# EAGLE schematic timer (EAGLE 9.3.1)
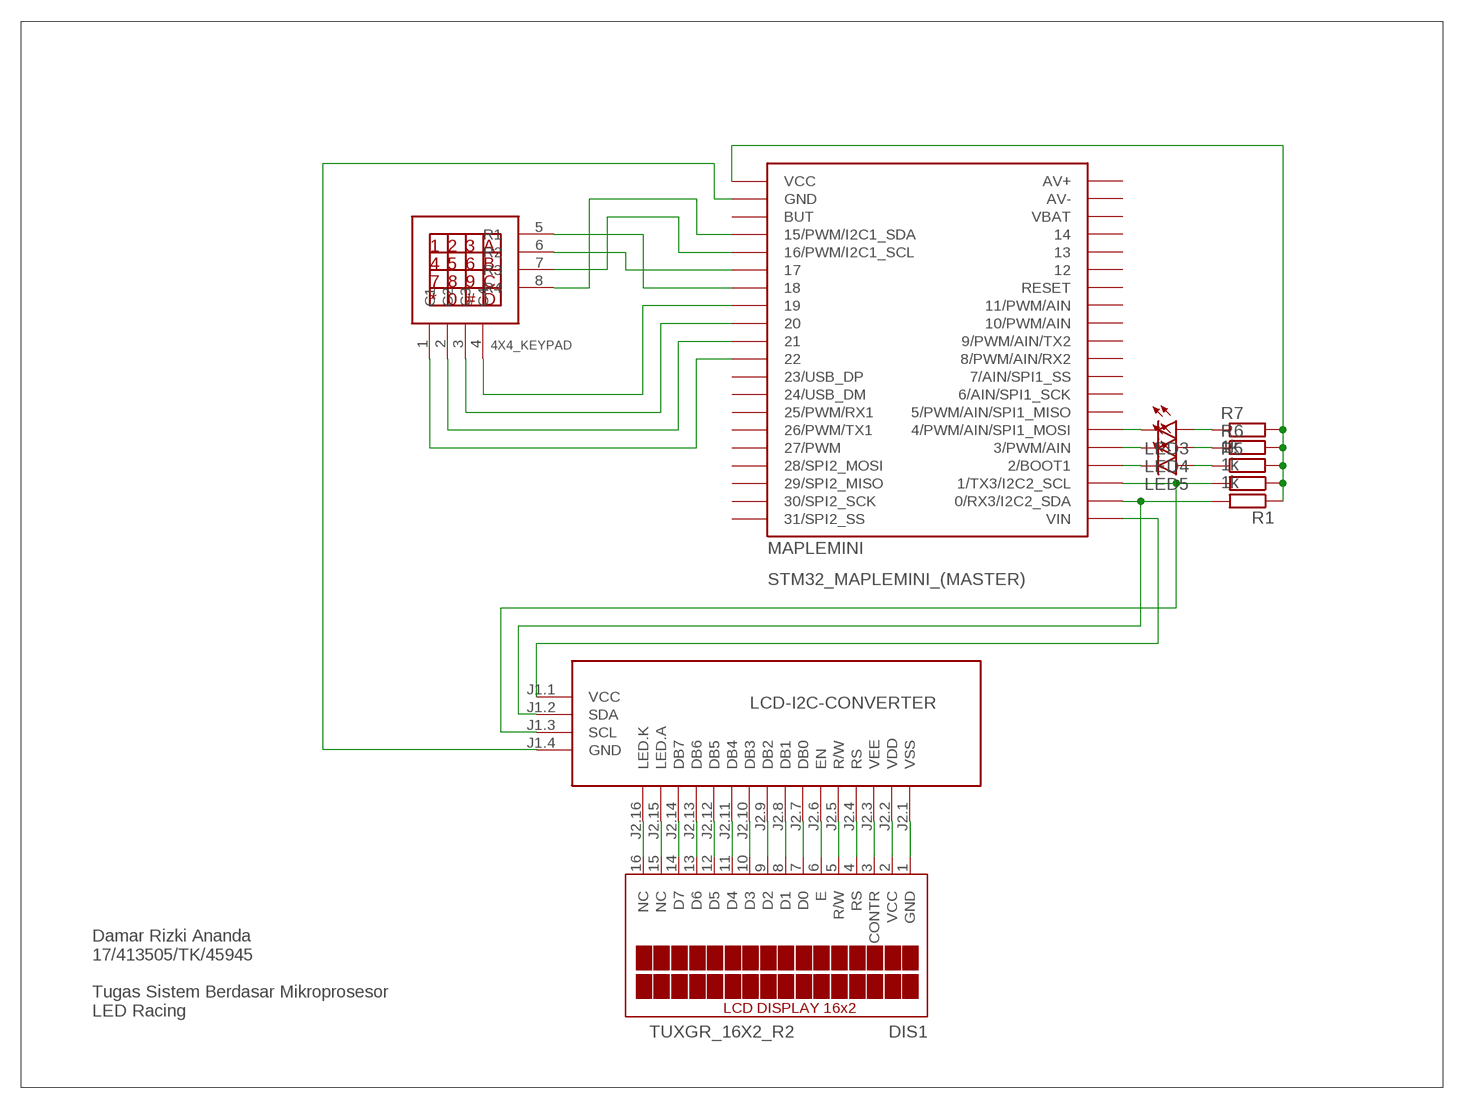
[diagram p0: schematic, sheet 1]

## Parts
4X4_KEYPAD  KEYPAD4X4  [KEYPAD4X4]
DIS1  TUXGR_16X2_R2  [TUXGR_16X2_R2]
LED3  LED3MM  [LED3MM]
LED4  LED3MM  [LED3MM]
LED5  LED3MM  [LED3MM]
R1  R-EU_0309/12  [0309/12]
R2  R-EU_0309/12  [0309/12]
R5  1k  R-EU_0204/7  [0204/7]
R6  1k  R-EU_0204/7  [0204/7]
R7  1k  R-EU_0204/7  [0204/7]
STM32_MAPLEMINI_(MASTER)  MAPLEMINI  [20-DIP]
U$1  LCD-I2C-CONVERTER  [LCD-I2C-CONVERTER]

## Nets
N$1: 4X4_KEYPAD.1(C1) STM32_MAPLEMINI_(MASTER).11
N$2: 4X4_KEYPAD.8(R4) STM32_MAPLEMINI_(MASTER).4(15/PWM/I2C1_SDA)
N$3: 4X4_KEYPAD.7(R3) STM32_MAPLEMINI_(MASTER).5(16/PWM/I2C1_SCL)
N$4: 4X4_KEYPAD.3(C3) STM32_MAPLEMINI_(MASTER).9
N$5: 4X4_KEYPAD.5(R1) STM32_MAPLEMINI_(MASTER).7
N$6: 4X4_KEYPAD.4(C4) STM32_MAPLEMINI_(MASTER).8
N$7: STM32_MAPLEMINI_(MASTER).21(VIN) U$1.J1.1(VCC)
N$8: R1.1 R2.1 R5.2 R6.2 R7.2 STM32_MAPLEMINI_(MASTER).1(VCC)
N$9: DIS1.1(GND) U$1.J2.1(VSS)
N$10: DIS1.2(VCC) U$1.J2.2(VDD)
N$11: DIS1.3(CONTR) U$1.J2.3(VEE)
N$12: DIS1.4(RS) U$1.J2.4(RS)
N$13: DIS1.5(R/W) U$1.J2.5(R/W)
N$14: DIS1.7(D0) U$1.J2.7(DB0)
N$15: DIS1.8(D1) U$1.J2.8(DB1)
N$16: DIS1.9(D2) U$1.J2.9(DB2)
N$17: DIS1.10(D3) U$1.J2.10(DB3)
N$18: DIS1.11(D4) U$1.J2.11(DB4)
N$19: DIS1.12(D5) U$1.J2.12(DB5)
N$20: DIS1.13(D6) U$1.J2.13(DB6)
N$21: DIS1.14(D7) U$1.J2.14(DB7)
N$22: DIS1.15(NC) U$1.J2.15(LED.A)
N$23: DIS1.16(NC) U$1.J2.16(LED.K)
N$24: DIS1.6(E) U$1.J2.6(EN)
N$25: R2.2 STM32_MAPLEMINI_(MASTER).23(1/TX3/I2C2_SCL) U$1.J1.3(SCL)
N$26: R1.2 STM32_MAPLEMINI_(MASTER).22(0/RX3/I2C2_SDA) U$1.J1.2(SDA)
N$29: STM32_MAPLEMINI_(MASTER).2(GND) U$1.J1.4(GND)
N$35: 4X4_KEYPAD.6(R2) STM32_MAPLEMINI_(MASTER).6
N$36: 4X4_KEYPAD.2(C2) STM32_MAPLEMINI_(MASTER).10
N$37: LED3.A R7.1
N$38: LED3.K(C) STM32_MAPLEMINI_(MASTER).26(4/PWM/AIN/SPI1_MOSI)
N$39: LED5.A R5.1
N$40: LED4.A R6.1
N$41: LED4.K(C) STM32_MAPLEMINI_(MASTER).25(3/PWM/AIN)
N$42: LED5.K(C) STM32_MAPLEMINI_(MASTER).24(2/BOOT1)
Unconnected: STM32_MAPLEMINI_(MASTER).3(BUT) STM32_MAPLEMINI_(MASTER).12(23/USB_DP) STM32_MAPLEMINI_(MASTER).13(24/USB_DM) STM32_MAPLEMINI_(MASTER).14(25/PWM/RX1) STM32_MAPLEMINI_(MASTER).15(26/PWM/TX1) STM32_MAPLEMINI_(MASTER).16(27/PWM) STM32_MAPLEMINI_(MASTER).17(28/SPI2_MOSI) STM32_MAPLEMINI_(MASTER).18(29/SPI2_MISO) STM32_MAPLEMINI_(MASTER).19(30/SPI2_SCK) STM32_MAPLEMINI_(MASTER).20(31/SPI2_SS) STM32_MAPLEMINI_(MASTER).27(5/PWM/AIN/SPI1_MISO) STM32_MAPLEMINI_(MASTER).28(6/AIN/SPI1_SCK) STM32_MAPLEMINI_(MASTER).29(7/AIN/SPI1_SS) STM32_MAPLEMINI_(MASTER).30(8/PWM/AIN/RX2) STM32_MAPLEMINI_(MASTER).31(9/PWM/AIN/TX2) STM32_MAPLEMINI_(MASTER).32(10/PWM/AIN) STM32_MAPLEMINI_(MASTER).33(11/PWM/AIN) STM32_MAPLEMINI_(MASTER).34(RESET) STM32_MAPLEMINI_(MASTER).35 STM32_MAPLEMINI_(MASTER).36 STM32_MAPLEMINI_(MASTER).37 STM32_MAPLEMINI_(MASTER).38(VBAT) STM32_MAPLEMINI_(MASTER).39(AV-) STM32_MAPLEMINI_(MASTER).40(AV+)

## Notes on the sheet
- Damar Rizki Ananda
  17/413505/TK/45945
  
  Tugas Sistem Berdasar Mikroprosesor
  LED Racing

## Library data of the parts
4X4_KEYPAD = keypad_4x4_raw:KEYPAD4X4
DIS1 = display-lcd:TUXGR_16X2_R2: Tuxgraphics LCD display 16x2 characters reflective, without background light Source: tuxgr_12x2_r2.pdf; OC_FARNELL: unknown; OC_NEWARK: unknown
LED3-LED5 = led:LED: LED OSRAM: - CHIPLED LG R971, LG N971, LY N971, LG Q971, LY Q971, LO R971, LY R971 LH N974, LH R974 LS Q976, LO Q976, LY Q976 LO Q996 - Hyper CHIPLED LW Q18S LB Q993, LB Q99A, LB R99A - SideLED LS A670, LO A670, LY A670, LG A670, LP A670 LB A673, LV A673, LT A673, LW A673 LH A674 LY A675 LS A676, LA A676, LO A676, LY A676, LW A676 LS A679, LY A679, LG A679 - Hyper Micro SIDELED® LS Y876, LA Y876, LO Y876, LY Y876 LT Y87S - SmartLED LW L88C, LW L88S LB L89C, LB L89S, LG L890 LS L89K, LO L89K, LY L89K LS L896, LA L896, LO L896, LY L896 - TOPLED LS T670, LO T670, LY T670, LG T670, LP T670 LSG T670, LSP T670, LSY T670, LOP T670, LYG T670 LG T671, LOG T671, LSG T671 LB T673, LV T673, LT T673, LW T673 LH T674 LS T676, LA T676, LO T676, LY T676, LB T676, LH T676, LSB T676, LW T676 LB T67C, LV T67C, LT T67C, LS T67K, LO T67K, LY T67K, LW E67C LS E67B, LA E67B, LO E67B, LY E67B, LB E67C, LV E67C, LT E67C LW T67C LS T679, LY T679, LG T679 LS T770, LO T770, LY T770, LG T770, LP T770 LB T773, LV T773, LT T773, LW T773 LH T774 LS E675, LA E675, LY E675, LS T675 LS T776, LA T776, LO T776, LY T776, LB T776 LHGB T686 LT T68C, LB T68C - Hyper Mini TOPLED® LB M676 - Mini TOPLED Santana® LG M470 LS M47K, LO M47K, LY M47K Source: http://www.osram.convergy.de LUXEON: - LUMILED® LXK2-PW12-R00, LXK2-PW12-S00, LXK2-PW14-U00, LXK2-PW14-V00 LXK2-PM12-R00, LXK2-PM12-S00, LXK2-PM14-U00 LXK2-PE12-Q00, LXK2-PE12-R00, LXK2-PE12-S00, LXK2-PE14-T00, LXK2-PE14-U00 LXK2-PB12-K00, LXK2-PB12-L00, LXK2-PB12-M00, LXK2-PB14-N00, LXK2-PB14-P00, LXK2-PB14-Q00 LXK2-PR12-L00, LXK2-PR12-M00, LXK2-PR14-Q00, LXK2-PR14-R00 LXK2-PD12-Q00, LXK2-PD12-R00, LXK2-PD12-S00 LXK2-PH12-R00, LXK2-PH12-S00 LXK2-PL12-P00, LXK2-PL12-Q00, LXK2-PL12-R00 Source: www.luxeon.com KINGBRIGHT: KA-3528ASYC Source: www.kingbright.com
R1 R2 = rcl:R-EU_: RESISTOR, European symbol; SPICEPREFIX: R
R5-R7 = resistor:R-EU_: RESISTOR, European symbol
STM32_MAPLEMINI_(MASTER) = maplemini:MAPLEMINI
U$1 = diy-modules:LCD-I2C-CONVERTER: I2C Bus to 4-Bit Parallel LCD Interface with LED backlight driver